# EAGLE design OW_Shield (EAGLE 5.08)
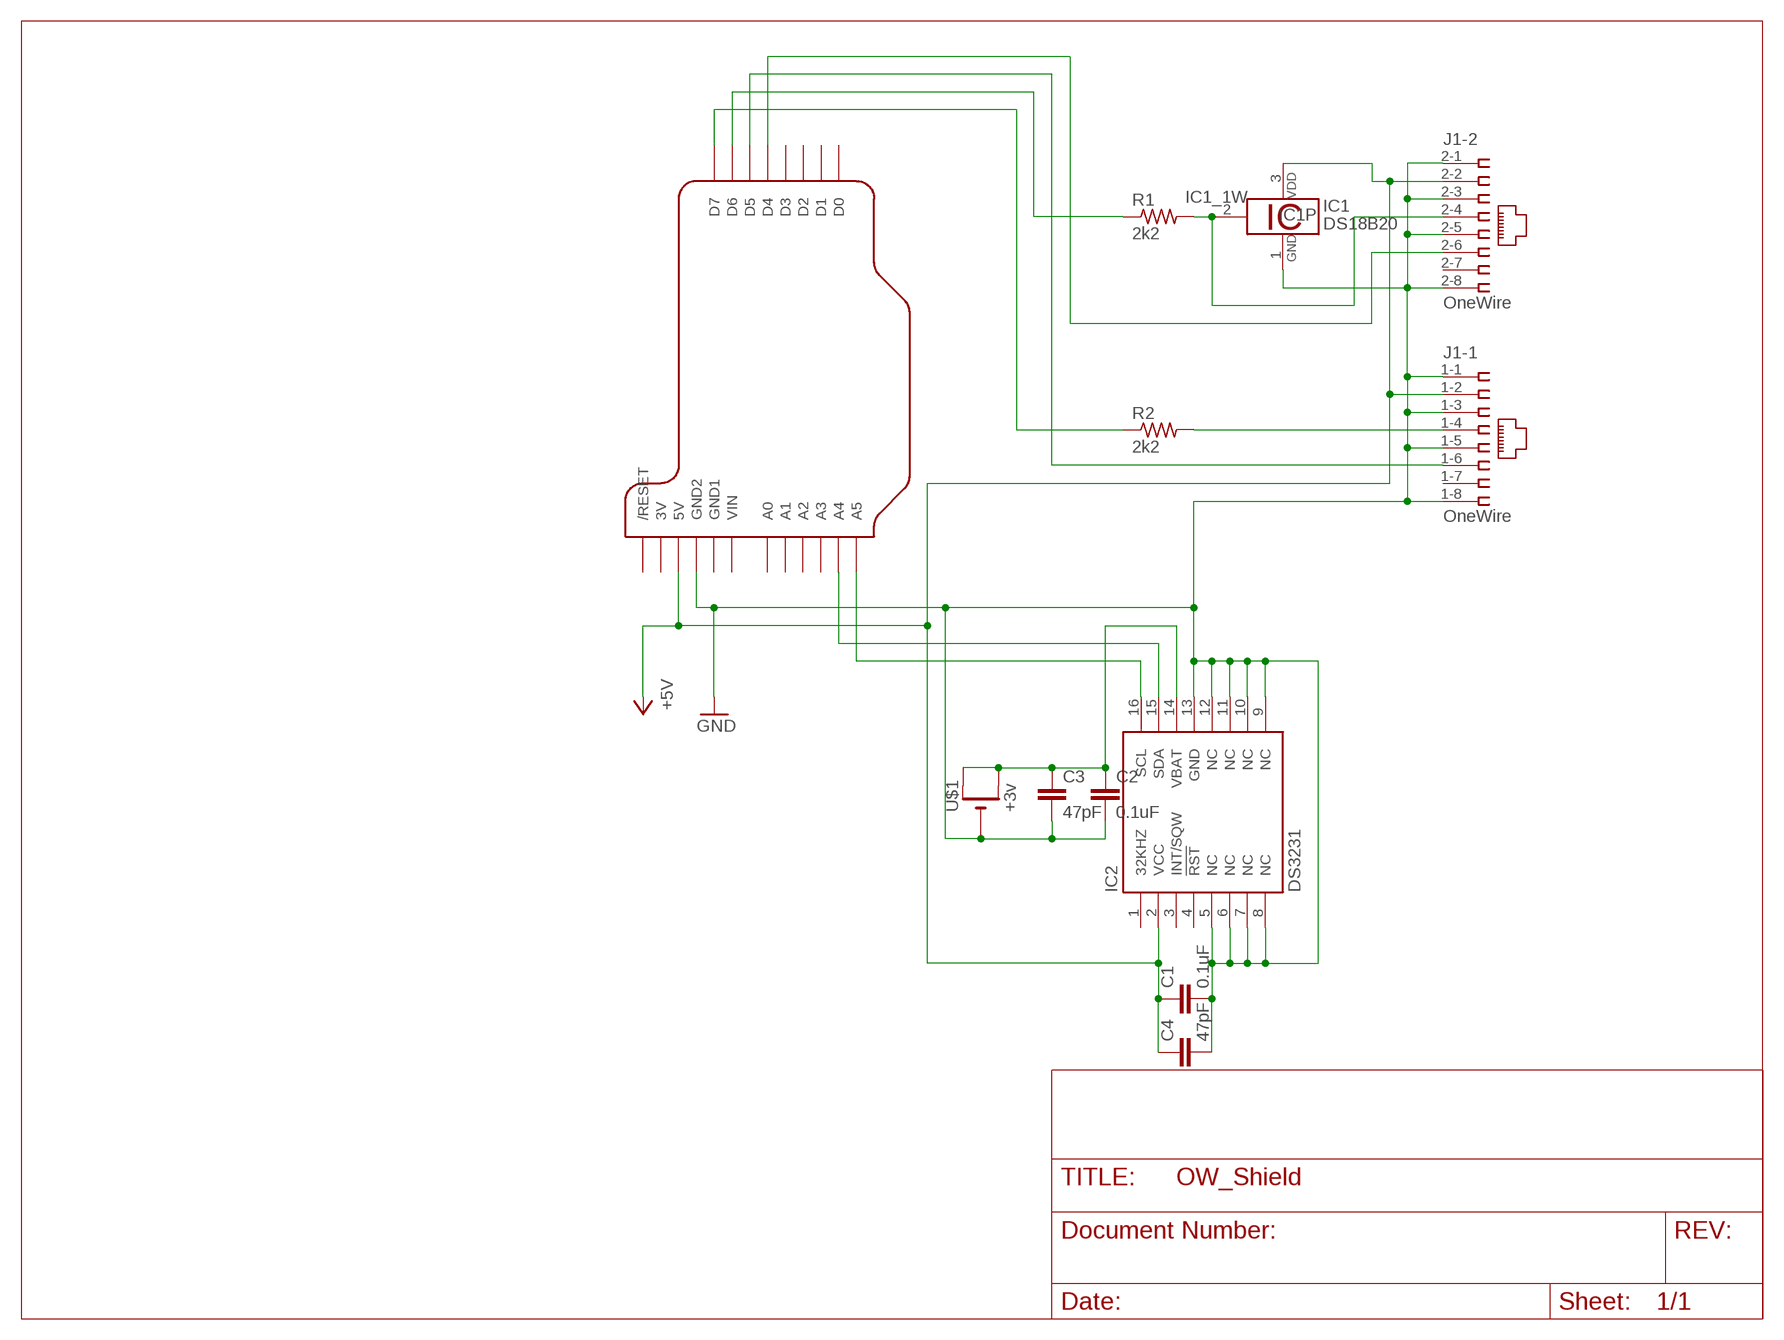
[diagram p0: schematic, sheet 1]

## Parts
C1  0.1uF  CAPPTH  [CAP-PTH-SMALL]
C2  0.1uF  CAPPTH  [CAP-PTH-SMALL]
C3  47pF  CAPPTH  [CAP-PTH-SMALL]
C4  47pF  CAPPTH  [CAP-PTH-SMALL]
IC1  DS18B20  [TO92-]
IC2  DS3231  [SO-16]
J1  OneWire  557560-1  [557560-1]
R1  2k2  R-US_0207/10  [0207/10]
R2  2k2  R-US_0207/10  [0207/10]
U$1  +3v  CR1220THM  [CR1220-THM]
U$2  ARDUINOSHORT  [ARDUINOSHORT]

## Nets
1W: IC1.2 J1.2-4 R1.2
+5V: C1.1 C4.1 IC1.3 IC2.2(VCC) J1.1-2 J1.2-2 U$2.5V
GND: C1.2 C2.2 C3.2 C4.2 IC1.1 IC2.5(NC) IC2.6(NC) IC2.7(NC) IC2.8(NC) IC2.9(NC) IC2.10(NC) IC2.11(NC) IC2.12(NC) IC2.13(GND) J1.1-1 J1.1-3 J1.1-5 J1.1-8 J1.2-1 J1.2-3 J1.2-5 J1.2-8 U$1.- U$2.GND2
N$1: IC2.15(SDA) U$2.A4
N$2: IC2.16(SCL) U$2.A5
N$3: C2.1 C3.1 IC2.14(VBAT) U$1.+1(+) U$1.+2(+1)
N$4: R1.1 U$2.D6
N$5: R2.1 U$2.D7
N$8: J1.1-4 R2.2
N$10: J1.1-6 U$2.D5
N$11: J1.2-6 U$2.D4
Unconnected: IC2.1(32KHZ) IC2.3(INT/SQW) IC2.4(!RST) J1.1-7 J1.2-7 U$2.A0 U$2.A1 U$2.A2 U$2.A3 U$2.D0 U$2.D1 U$2.D2 U$2.D3 U$2.RESET(/RESET)

## Power pins joined to a net without a drawn wire
3V: U$2.3V
GND1: U$2.GND1
VIN: U$2.VIN

## Library data of the parts
C1-C4 = SparkFun:CAP: Capacitor Standard 0603 ceramic capacitor, and 0.1" leaded capacitor.
IC1 = 1wire:DS18B20: Programmable Resolution Digital Thermometer This chip provides a onewire thermosensor with approx. 0.5°C accuracy. A programmable over/undertemperure alarm is available. The precision can be set from 9..12 bits. Notes: Vdd must be applied for accurate measurements at low temperatures, as the parasite power circuit otherwise heats the sensor. If parasite power is used, Vdd has to be connected to GND. The DS1822 is a low-cost thermometer chip, the DS18S20 is similar to the DS18B20, but with 9 Bit precision only. Author: Jan Kandziora <jjj@gmx.de>
IC2 = ds3231:DS3231: DS3231 RTC
J1 = con-amp:557560-1: AMP connector
R1 R2 = resistor:R-US_: RESISTOR, American symbol
U$1 = adafruit:CR1220: CR1216/CR1220/CR1225 12mm 3V lithium coin cell Great for battery packup. Both SMT and THM holders. Note the THM package has the ground pads on both sides of the PCB so that the masks are the same - this reduces the cost
U$2 = gfb:ARDUINOSHORT

## Board
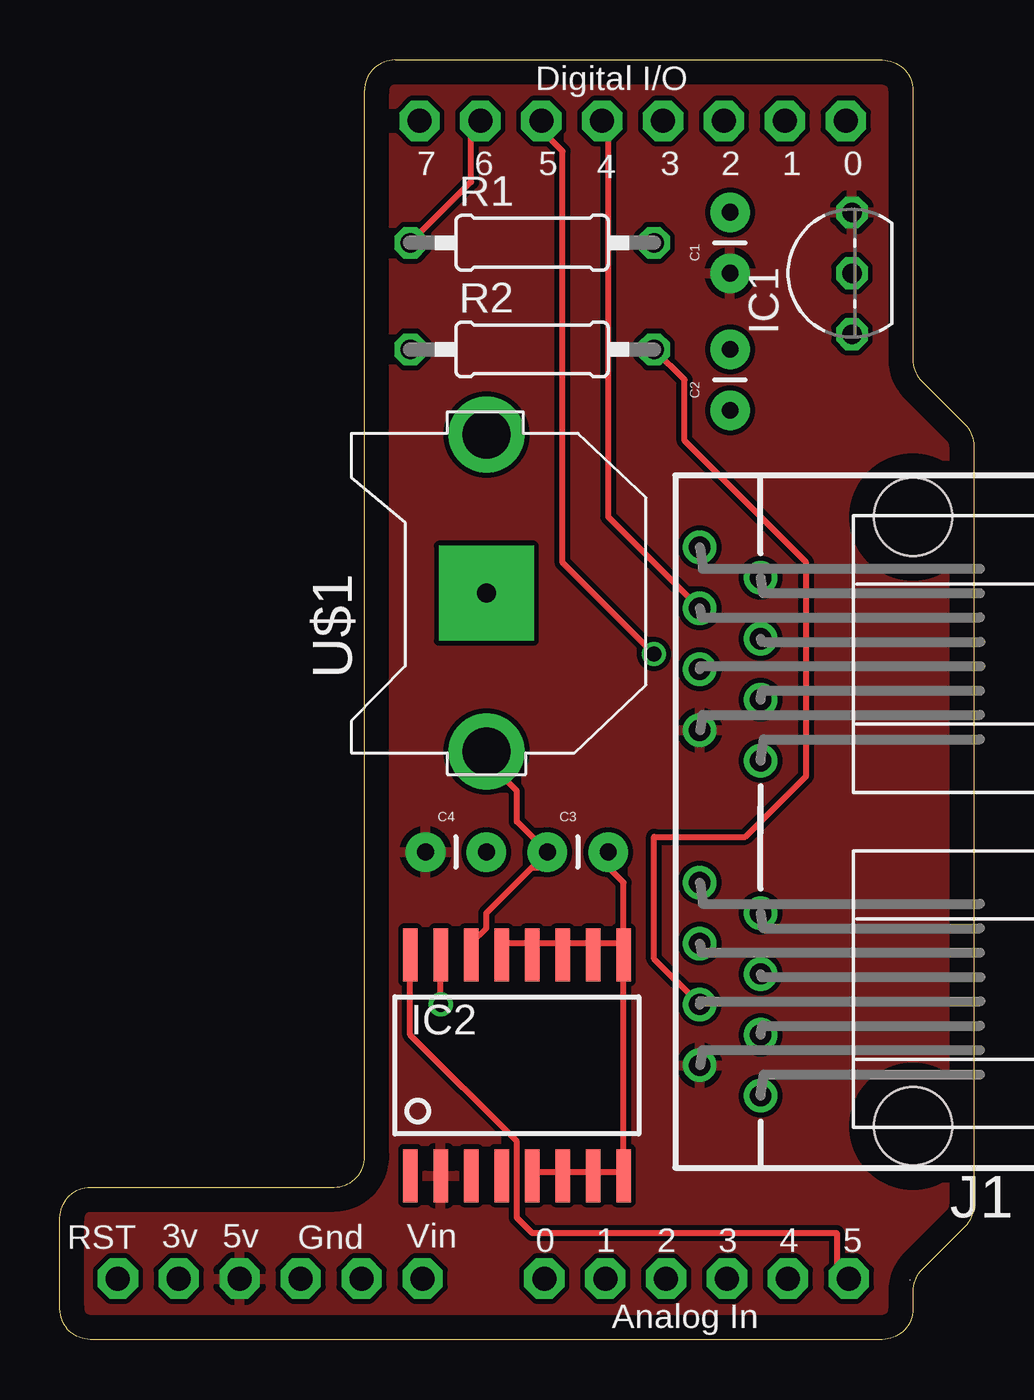
[diagram p1: board, top side]
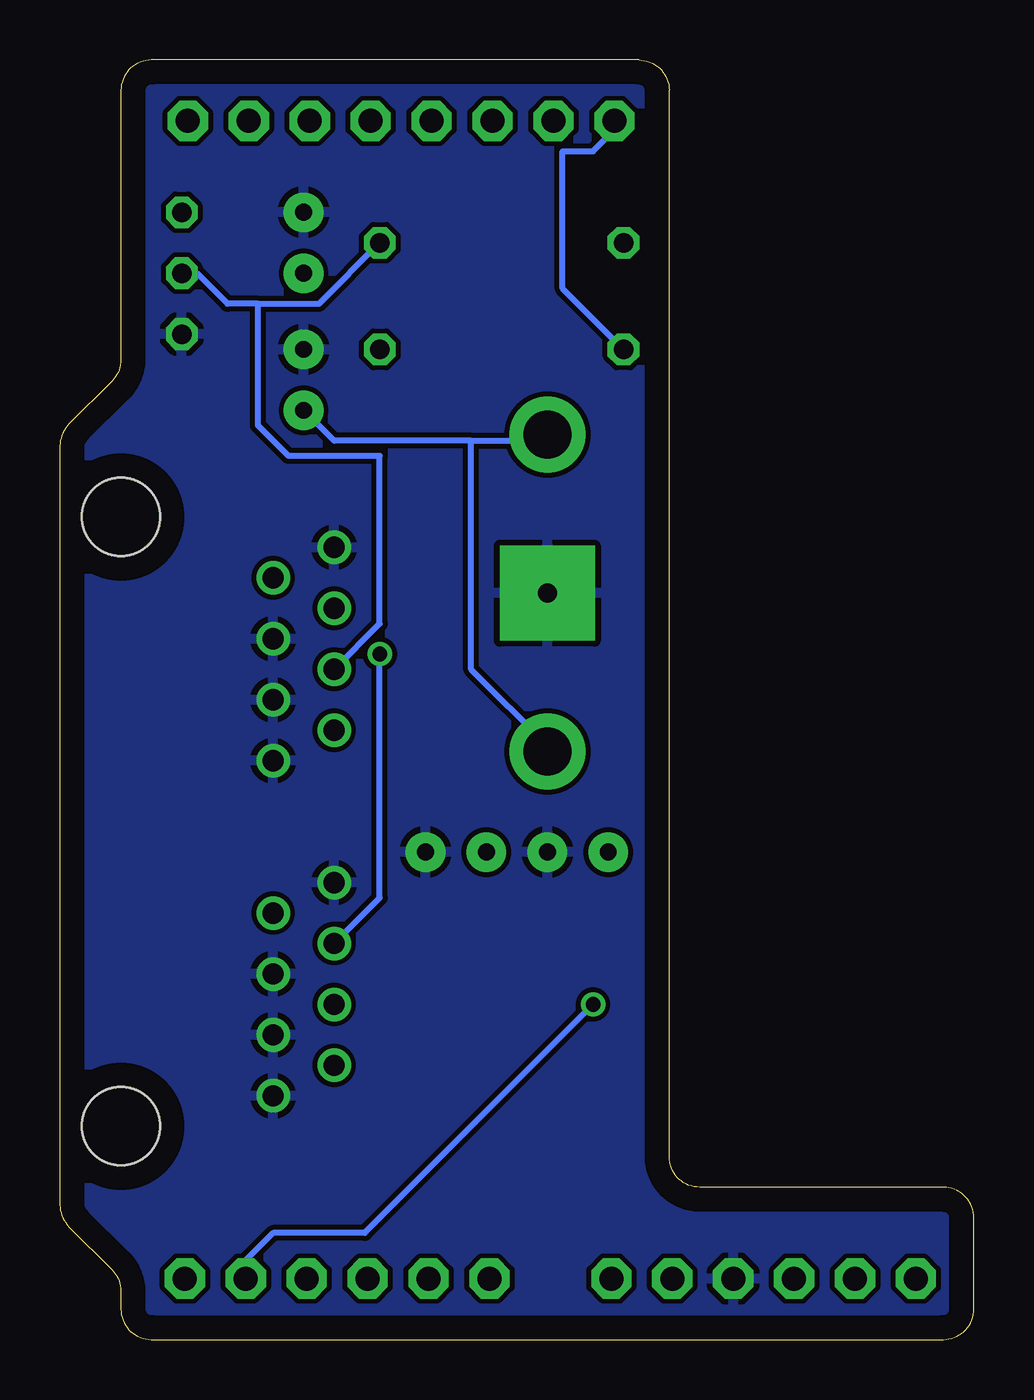
[diagram p2: board, bottom side, seen from below]

Size 38.1 x 53.34 mm. Coordinates in mm from the lower left corner, seen from the top.
Copper layers (1*16): Top 0.035mm / dielectric 1.5mm / Bottom 0.035mm
Design rules "default": minimum track width 10mil, minimum drill 24mil, track to track 8mil, track to pad 8mil, pad to pad 8mil, via to via 8mil, smd to smd 8mil, copper to edge 40mil, drill to drill 8mil, minimum pad ring 10mil, minimum via ring 8mil, stop-mask expansion 4mil, vias tented up to drill 0mil, thermal gap 10mil

### Footprints (pad centres in the part's own frame; a part is rotated, then mirrored left to right if it is on the bottom)
CAP-PTH-SMALL = drill 0.7 pad 1.651 round: 1 0,0; 2 2.54,0
TO92- = drill 0.813 octagon: 1 -2.54,0; 2 0,0; 3 2.54,0
SO-16 = smd 0.6 x 2.2: 1 -4.445,-4.6; 2 -3.175,-4.6; 3 -1.905,-4.6; 4 -0.635,-4.6; 5 0.635,-4.6; 6 1.905,-4.6; 7 3.175,-4.6; 8 4.445,-4.6; 9 4.445,4.6; 10 3.175,4.6; 11 1.905,4.6; 12 0.635,4.6; 13 -0.635,4.6; 14 -1.905,4.6; 15 -3.175,4.6; 16 -4.445,4.6
557560-1 = drill 0.889 round: 1-1 -11.43,6.35; 1-2 -10.16,8.89; 1-3 -8.89,6.35; 1-4 -7.62,8.89; 1-5 -6.35,6.35; 1-6 -5.08,8.89; 1-7 -3.81,6.35; 1-8 -2.54,8.89; 2-1 2.54,6.35; 2-2 3.81,8.89; 2-3 5.08,6.35; 2-4 6.35,8.89; 2-5 7.62,6.35; 2-6 8.89,8.89; 2-7 10.16,6.35; 2-8 11.43,8.89 | hole 3.251: -12.7,0; 12.7,0
0207/10 = drill 0.813 octagon: 1 -5.08,0; 2 5.08,0
CR1220-THM = drill 2 pad 3.175 round: +1 -6.604,0; +2 6.604,0 | drill 0.8 pad 3.962 square: - 0,0
ARDUINOSHORT = drill 1 pad 1.676 octagon: 3V 4.953,2.54; 5V 7.493,2.54; A0 20.193,2.54; A1 22.733,2.54; A2 25.273,2.54; A3 27.813,2.54; A4 30.353,2.54; A5 32.893,2.54; D0 32.766,50.8; D1 30.226,50.8; D2 27.686,50.8; D3 25.146,50.8; D4 22.606,50.8; D5 20.066,50.8; D6 17.526,50.8; D7 14.986,50.8; GND1 12.573,2.54; GND2 10.033,2.54; RESET 2.413,2.54; VIN 15.113,2.54

### Placement (x,y rotation side)
C1  27.94,44.45 90 top
C2  27.94,38.73 90 top
C3  20.32,20.32 0 top
C4  15.24,20.32 0 top
IC1  33.02,44.45 90 top
IC2  19.05,11.43 0 top
J1  35.56,21.59 90 top
R1  19.68,45.72 0 top
R2  19.68,41.27 0 top
U$1  17.78,31.11 90 top
U$2  0,0 0 top

### Tracks (layer width: path | path; a pad name or v marks a point on that pad's centre or on a via)
1W
  Bottom 0.254: R1.2 27.3,43.18 29.84,43.18 | 29.84,43.18 31.11,43.18 32.38,44.45 IC1.2 | J1.2-4 24.77,29.84 24.77,36.83 28.57,36.83 29.84,38.1 29.84,43.18
+5V
  pour Top: 0,0 40.01,0 40.01,53.98 0,53.98
GND
  Top 0.254: 20.95,6.99 19.68,6.99 IC2.5 | 20.95,6.99 22.23,6.99 | 20.95,6.99 IC2.6 | 22.23,6.99 23.5,6.99 | 22.23,6.99 IC2.7 | 19.68,16.51 18.41,16.51 IC2.13 | 20.95,16.51 19.68,16.51 | 19.68,16.51 IC2.12 | 22.23,16.51 20.95,16.51 | 20.95,16.51 IC2.11 | 23.5,16.51 22.23,16.51 | 22.23,16.51 IC2.10 | 23.5,6.99 IC2.8 | 23.5,6.99 IC2.9 23.5,16.51 | 23.5,16.51 23.5,19.05 22.86,19.68 C3.2
  pour Bottom: -0.64,54.61 40.64,54.61 40.64,-0.64 -0.64,-0.64
N$1  (via drill 0.61)
  Top 0.254: v15.88,13.97 IC2.15
  Bottom 0.254: v15.88,13.97 25.4,4.45 29.21,4.45 30.48,3.17 30.48,2.54 U$2.A4
N$2
  Top 0.254: IC2.16 14.61,12.7 19.05,8.26 19.05,5.08 19.68,4.45 32.38,4.45 32.38,2.54 U$2.A5
N$3
  Top 0.254: IC2.14 17.14,16.51 17.78,17.14 17.78,17.78 19.68,19.68 20.32,19.68 C3.1 19.05,21.59 19.05,22.86 17.78,24.13 U$1.+1
  Bottom 0.254: C2.1 26.67,37.47 20.95,37.47 | 20.95,37.47 17.78,37.47 U$1.+2 | 20.95,37.47 20.95,27.94 17.78,24.77 U$1.+1
N$4
  Top 0.254: R1.1 17.14,48.26 17.14,50.8 U$2.D6
N$5
  Bottom 0.254: R2.1 17.14,43.81 17.14,49.53 15.88,49.53 14.61,50.8 U$2.D7
N$8
  Top 0.254: R2.2 26.04,40.01 26.04,37.47 31.11,32.38 31.11,23.5 28.57,20.95 24.77,20.95 24.77,15.88 J1.1-4
N$10  (via drill 0.61)
  Top 0.254: v24.77,28.57 20.95,32.38 20.95,49.53 20.32,50.16 20.32,50.8 U$2.D5
  Bottom 0.254: J1.1-6 24.77,18.41 v24.77,28.57
N$11
  Top 0.254: J1.2-6 22.86,34.29 22.86,50.8 U$2.D4